# EAGLE design Main Board (EAGLE 7.7.0)
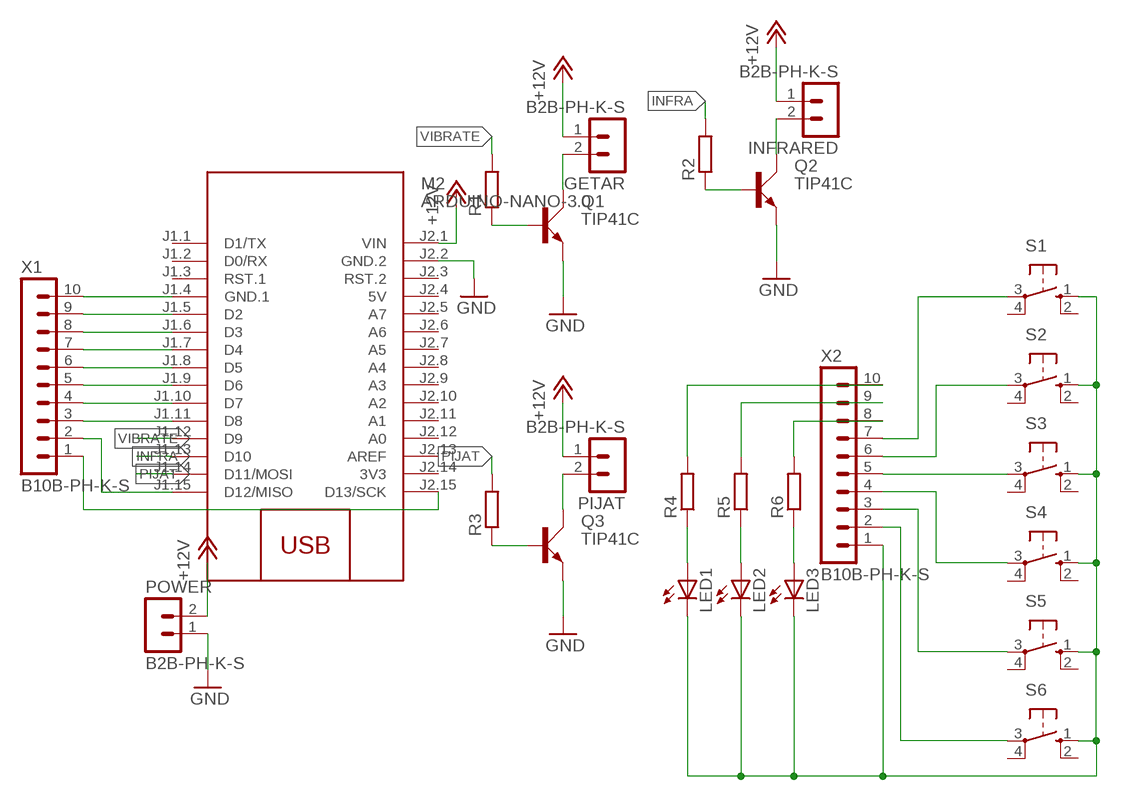
[diagram p0: schematic, sheet 1]

## Parts
GETAR  B2B-PH-K-S  [B2B-PH-K-S]
INFRARED  B2B-PH-K-S  [B2B-PH-K-S]
LED1  LED5MM  [LED5MM]
LED2  LED5MM  [LED5MM]
LED3  LED5MM  [LED5MM]
M2  ARDUINO-NANO-3.0  [ARDUINO-NANO-3.0]
PIJAT  B2B-PH-K-S  [B2B-PH-K-S]
POWER  B2B-PH-K-S  [B2B-PH-K-S]
Q1  TIP41C  [TO220AV]
Q2  TIP41C  [TO220AV]
Q3  TIP41C  [TO220AV]
R1  R-EU_0207/12  [0207/12]
R2  R-EU_0207/12  [0207/12]
R3  R-EU_0207/12  [0207/12]
R4  R-EU_0207/12  [0207/12]
R5  R-EU_0207/12  [0207/12]
R6  R-EU_0207/12  [0207/12]
S1  40-XX  [B3F-40XX]
S2  40-XX  [B3F-40XX]
S3  40-XX  [B3F-40XX]
S4  40-XX  [B3F-40XX]
S5  40-XX  [B3F-40XX]
S6  40-XX  [B3F-40XX]
X1  B10B-PH-K-S  [B10B-PH-K-S]
X2  B10B-PH-K-S  [B10B-PH-K-S]

## Nets
+12V: GETAR.1 INFRARED.1 M2.J2.1(VIN) PIJAT.1 POWER.2
GND: M2.J2.2(GND.2) POWER.1 Q1.E Q2.E Q3.E
INFRA: M2.J1.13(D10) R2.2
N$1: INFRARED.2 Q2.C
N$2: GETAR.2 Q1.C
N$3: PIJAT.2 Q3.C
N$4: M2.J1.4(GND.1) X1.10
N$5: M2.J1.5(D2) X1.9
N$6: M2.J1.6(D3) X1.8
N$7: M2.J1.7(D4) X1.7
N$8: M2.J1.8(D5) X1.6
N$9: M2.J1.9(D6) X1.5
N$10: Q2.B R2.1
N$11: S1.3(P) X2.7
N$12: S2.3(P) X2.6
N$13: S5.3(P) X2.3
N$14: S4.3(P) X2.4
N$15: S3.3(P) X2.5
N$16: M2.J1.10(D7) X1.4
N$17: Q1.B R1.1
N$18: Q3.B R3.1
N$20: M2.J1.11(D8) X1.3
N$21: M2.J1.15(D12/MISO) X1.2
N$22: S6.3(P) X2.2
N$23: M2.J2.15(D13/SCK) X1.1
N$24: LED1.A R4.1
N$25: LED2.A R5.1
N$26: LED3.A R6.1
N$27: R4.2 X2.10
N$28: R5.2 X2.9
N$29: R6.2 X2.8
N$30: LED1.K(C) LED2.K(C) LED3.K(C) S1.1(S) S2.1(S) S3.1(S) S4.1(S) S5.1(S) S6.1(S) X2.1
PIJAT: M2.J1.14(D11/MOSI) R3.2
VIBRATE: M2.J1.12(D9) R1.2
Unconnected: M2.J1.1(D1/TX) M2.J1.2(D0/RX) M2.J1.3(RST.1) M2.J2.3(RST.2) M2.J2.5(A7) M2.J2.6(A6) M2.J2.7(A5) M2.J2.8(A4) M2.J2.9(A3) M2.J2.10(A2) M2.J2.11(A1) M2.J2.12(A0) M2.J2.13(AREF) S1.2(S1) S1.4(P1) S2.2(S1) S2.4(P1) S3.2(S1) S3.4(P1) S4.2(S1) S4.4(P1) S5.2(S1) S5.4(P1) S6.2(S1) S6.4(P1)

## Power pins joined to a net without a drawn wire
3V3: M2.J2.14(3V3)
5V: M2.J2.4(5V)

## Library data of the parts
GETAR INFRARED PIJAT POWER = con-JST PH:B2B-PH: JST PH series header 2.00mm pitch disconnectable crimp style connectors, vertical (side entry type), 2 pins
LED1-LED3 = led:LED: LED OSRAM: - CHIPLED LG R971, LG N971, LY N971, LG Q971, LY Q971, LO R971, LY R971 LH N974, LH R974 LS Q976, LO Q976, LY Q976 LO Q996 - Hyper CHIPLED LW Q18S LB Q993, LB Q99A, LB R99A - SideLED LS A670, LO A670, LY A670, LG A670, LP A670 LB A673, LV A673, LT A673, LW A673 LH A674 LY A675 LS A676, LA A676, LO A676, LY A676, LW A676 LS A679, LY A679, LG A679 - Hyper Micro SIDELED® LS Y876, LA Y876, LO Y876, LY Y876 LT Y87S - SmartLED LW L88C, LW L88S LB L89C, LB L89S, LG L890 LS L89K, LO L89K, LY L89K LS L896, LA L896, LO L896, LY L896 - TOPLED LS T670, LO T670, LY T670, LG T670, LP T670 LSG T670, LSP T670, LSY T670, LOP T670, LYG T670 LG T671, LOG T671, LSG T671 LB T673, LV T673, LT T673, LW T673 LH T674 LS T676, LA T676, LO T676, LY T676, LB T676, LH T676, LSB T676, LW T676 LB T67C, LV T67C, LT T67C, LS T67K, LO T67K, LY T67K, LW E67C LS E67B, LA E67B, LO E67B, LY E67B, LB E67C, LV E67C, LT E67C LW T67C LS T679, LY T679, LG T679 LS T770, LO T770, LY T770, LG T770, LP T770 LB T773, LV T773, LT T773, LW T773 LH T774 LS E675, LA E675, LY E675, LS T675 LS T776, LA T776, LO T776, LY T776, LB T776 LHGB T686 LT T68C, LB T68C - Hyper Mini TOPLED® LB M676 - Mini TOPLED Santana® LG M470 LS M47K, LO M47K, LY M47K Source: http://www.osram.convergy.de LUXEON: - LUMILED® LXK2-PW12-R00, LXK2-PW12-S00, LXK2-PW14-U00, LXK2-PW14-V00 LXK2-PM12-R00, LXK2-PM12-S00, LXK2-PM14-U00 LXK2-PE12-Q00, LXK2-PE12-R00, LXK2-PE12-S00, LXK2-PE14-T00, LXK2-PE14-U00 LXK2-PB12-K00, LXK2-PB12-L00, LXK2-PB12-M00, LXK2-PB14-N00, LXK2-PB14-P00, LXK2-PB14-Q00 LXK2-PR12-L00, LXK2-PR12-M00, LXK2-PR14-Q00, LXK2-PR14-R00 LXK2-PD12-Q00, LXK2-PD12-R00, LXK2-PD12-S00 LXK2-PH12-R00, LXK2-PH12-S00 LXK2-PL12-P00, LXK2-PL12-Q00, LXK2-PL12-R00 Source: www.luxeon.com KINGBRIGHT: KA-3528ASYC Source: www.kingbright.com
M2 = diy-modules:ARDUINO-NANO-3.0: Arduino Nano 3.0 and compatible devices More details available here: https://www.arduino.cc/en/Main/ArduinoBoardNano Click here to find device on ebay.com <http://www.ebay.com/sch/arduino+nano>
Q1-Q3 = transistor-power:TIP41C: NPN TRANSISTOR
R1-R6 = rcl:R-EU_: RESISTOR, European symbol
S1-S6 = switch-omron:40-XX: OMRON SWITCH; MF: OMRON COMPONENTS USA; MPN: B3F-4000; OC_FARNELL: 176434; OC_NEWARK: 36K3105
X1 X2 = con-JST PH:B10B-PH: JST PH series header 2.00mm pitch disconnectable crimp style connectors, vertical (side entry type), 10 pins

## Board
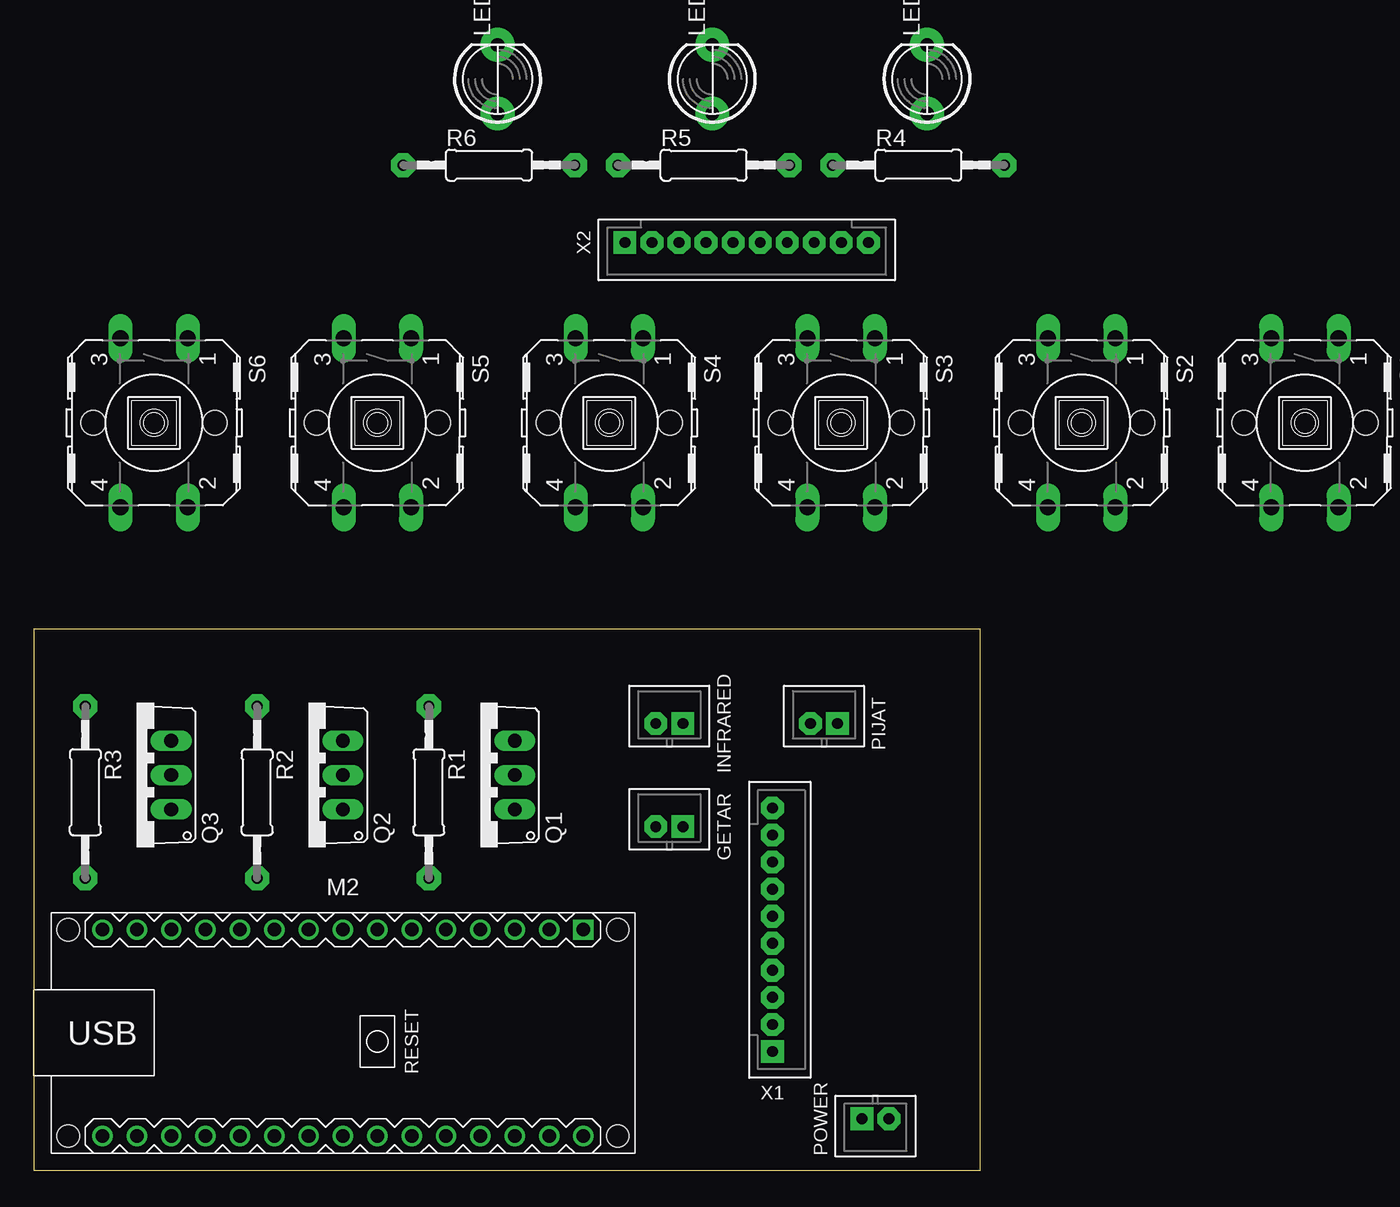
[diagram p1: board, top side]
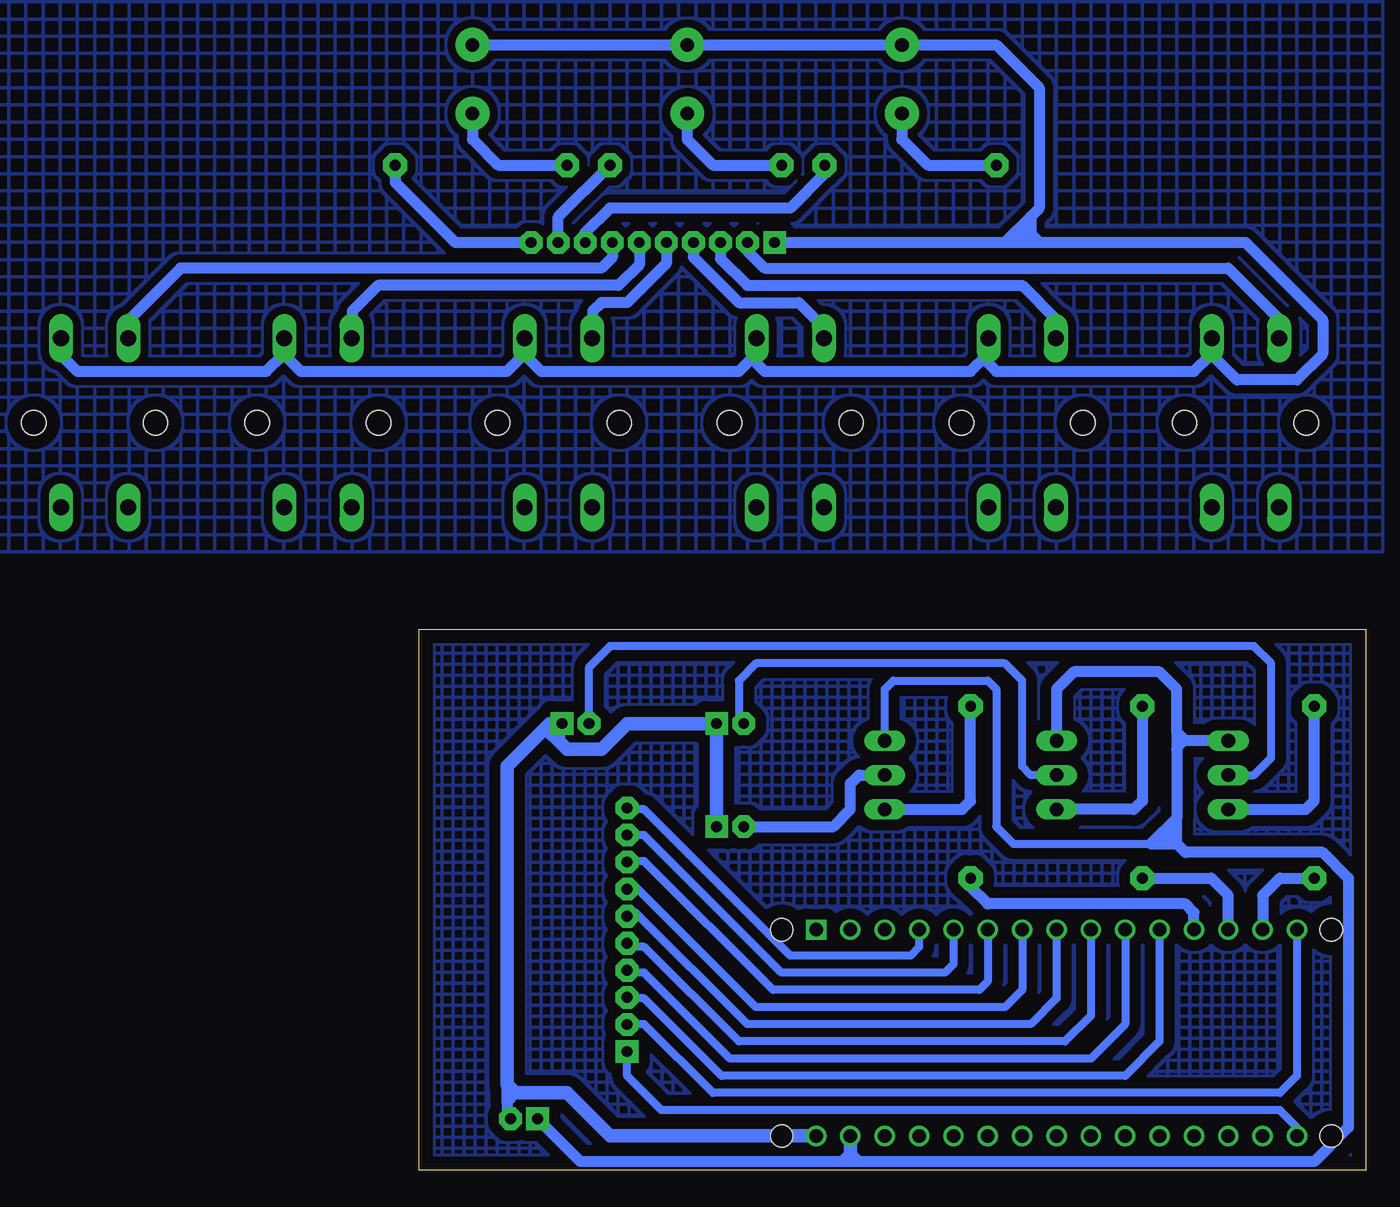
[diagram p2: board, bottom side, seen from below]

Size 70 x 40 mm. Coordinates in mm from the lower left corner, seen from the top.
Outline: 0,0 70,0 70,40 0,40 0,0
Copper layers (1*16): Top 0.035mm / dielectric 1.5mm / Bottom 0.035mm
Design rules "default": minimum track width 10mil, minimum drill 24mil, track to track 8mil, track to pad 8mil, pad to pad 8mil, via to via 8mil, smd to smd 8mil, copper to edge 40mil, drill to drill 8mil, minimum pad ring 10mil, minimum via ring 8mil, stop-mask expansion 4mil, vias tented up to drill 0mil, thermal gap 10mil

### Footprints (pad centres in the part's own frame; a part is rotated, then mirrored left to right if it is on the bottom)
B2B-PH-K-S = drill 0.8 pad 1.676 square: 1 1,0 | drill 0.8 pad 1.676 octagon: 2 -1,0
LED5MM = drill 1 pad 2.5: A -2.54,0; K 2.54,0
ARDUINO-NANO-3.0 = drill 1 square: J1.1 17.78,7.62 | drill 1: J1.2 15.24,7.62; J1.3 12.7,7.62; J1.4 10.16,7.62; J1.5 7.62,7.62; J1.6 5.08,7.62; J1.7 2.54,7.62; J1.8 0,7.62; J1.9 -2.54,7.62; J1.10 -5.08,7.62; J1.11 -7.62,7.62; J1.12 -10.16,7.62; J1.13 -12.7,7.62; J1.14 -15.24,7.62; J1.15 -17.78,7.62; J2.1 17.78,-7.62; J2.2 15.24,-7.62; J2.3 12.7,-7.62; J2.4 10.16,-7.62; J2.5 7.62,-7.62; J2.6 5.08,-7.62; J2.7 2.54,-7.62; J2.8 0,-7.62; J2.9 -2.54,-7.62; J2.10 -5.08,-7.62; J2.11 -7.62,-7.62; J2.12 -10.16,-7.62; J2.13 -12.7,-7.62; J2.14 -15.24,-7.62; J2.15 -17.78,-7.62 | hole 1.651: -20.32,7.62; -20.32,-7.62; 20.32,-7.62; 20.32,7.62
TO220AV = drill 1.016 long: B -2.54,-2.54; C 0,-2.54; E 2.54,-2.54
0207/12 = drill 0.8 pad 1.778 octagon: 1 -6.35,0; 2 6.35,0
B3F-40XX = drill 1.194 long: 1 -6.248,2.489; 2 6.248,2.489; 3 -6.248,-2.489; 4 6.248,-2.489 | hole 1.803: 0,-4.496; 0,4.496
B10B-PH-K-S = drill 0.8 pad 1.676 square: 1 9,0 | drill 0.8 pad 1.676 octagon: 2 7,0; 3 5,0; 4 3,0; 5 1,0; 6 -1,0; 7 -3,0; 8 -5,0; 9 -7,0; 10 -9,0

### Placement (x,y rotation side)
GETAR  46.99,25.4 0 top
INFRARED  46.99,33.02 0 top
LED1  66.04,80.64 90 top  (outside the outline)
LED2  50.16,80.64 90 top  (outside the outline)
LED3  34.29,80.64 90 top  (outside the outline)
M2  22.86,10.16 0 top
PIJAT  58.42,33.02 0 top
POWER  62.23,3.81 180 top
Q1  33.02,29.21 90 top
Q2  20.32,29.21 90 top
Q3  7.62,29.21 90 top
R1  29.21,27.94 270 top
R2  16.51,27.94 270 top
R3  3.81,27.94 270 top
R4  65.41,74.3 0 top  (outside the outline)
R5  49.53,74.3 0 top  (outside the outline)
R6  33.66,74.3 0 top  (outside the outline)
S1  93.98,55.24 270 top  (outside the outline)
S2  77.47,55.24 270 top  (outside the outline)
S3  59.69,55.24 270 top  (outside the outline)
S4  42.55,55.24 270 top  (outside the outline)
S5  25.4,55.24 270 top  (outside the outline)
S6  8.89,55.24 270 top  (outside the outline)
X1  54.61,17.78 270 top
X2  52.7,68.58 180 top  (outside the outline)

### Tracks (layer width: path | path; a pad name or v marks a point on that pad's centre or on a via)
+12V
  Bottom 0.813: 62.87,5.71 63.5,5.08 | 63.5,5.08 63.5,4.08 POWER.2 | 63.5,5.08 63.5,6.35
  Bottom 1.016: GETAR.1 INFRARED.1 54.61,33.02 56.52,31.11 59.05,31.11 59.69,31.75 | 59.69,31.75 59.69,32.75 PIJAT.1 60.33,33.02 63.5,29.84 63.5,6.35 62.87,5.71 59.05,5.71 55.88,2.54 M2.J2.1 | 59.69,31.75 60.33,32.38
GND
  Bottom 0.61: Q1.E 35.56,35.56 34.92,36.2 27.94,36.2 27.3,35.56 27.3,25.4 26.04,24.13 15.88,24.13 14.92,25.08 13.97,26.04 | 13.97,31.11 13.34,31.75
  Bottom 0.813: 38.73,0.64 38.1,1.27 37.47,0.64 | Q3.E 13.34,31.75 13.97,32.38 | 13.97,32.38 13.97,35.56 15.24,36.83 21.59,36.83 22.86,35.56 Q2.E | 13.97,24.13 13.34,23.5 3.17,23.5 1.27,21.59 1.27,3.17 3.81,0.64 37.47,0.64 | 13.97,24.13 14.92,25.08 | 13.97,32.38 13.97,31.11 13.97,26.04 | 13.97,26.04 15.88,24.13 13.97,24.13 | 13.97,24.13 13.97,26.04 | 37.47,0.64 38.73,0.64 | 38.73,0.64 58.05,0.64 POWER.1
  Bottom 1.016: 38.1,1.27 M2.J2.2
INFRA
  Bottom 0.813: R2.2 11.43,21.59 10.16,20.32 M2.J1.13
N$1
  Bottom 0.61: Q2.C 24.77,29.21 25.4,29.84 25.4,36.2 26.67,37.47 45.09,37.47 46.35,36.2 46.35,33.38 INFRARED.2
N$2
  Bottom 0.813: GETAR.2 39.37,25.4 38.1,26.67 38.1,28.57 37.47,29.21 Q1.C
N$3
  Bottom 0.61: Q3.C 8.26,29.21 6.99,30.48 6.99,37.47 8.26,38.73 55.88,38.73 57.42,37.2 PIJAT.2
N$4
  Bottom 0.61: X1.10 54.5,26.67 53.34,26.67 42.55,15.88 33.66,15.88 33.02,16.51 M2.J1.4
N$5
  Bottom 0.61: X1.9 54.59,24.77 53.34,24.77 43.18,14.61 31.11,14.61 30.48,15.24 M2.J1.5
N$6
  Bottom 0.61: M2.J1.6 27.94,13.97 28.57,13.34 43.81,13.34 53.34,22.86 54.53,22.86 X1.8
N$7
  Bottom 0.61: M2.J1.7 25.4,13.34 26.67,12.06 45.09,12.06 53.98,20.95 54.44,20.95 X1.7
N$8
  Bottom 0.61: X1.6 54.34,19.05 53.98,19.05 45.72,10.79 24.77,10.79 22.86,12.7 M2.J1.8
N$9
  Bottom 0.61: M2.J1.9 20.32,11.43 22.23,9.53 46.35,9.53 53.34,16.51 54.34,16.51 X1.5
N$10
  Bottom 0.813: R2.1 16.51,27.3 17.14,26.67 Q2.B
N$11
  Bottom 0.813: X2.7 55.7,67.48 56.52,66.67 87.63,66.67 91.44,62.87 91.44,61.54 S1.3
N$12
  Bottom 0.813: X2.6 53.7,66.94 55.24,65.41 73.03,65.41 74.93,63.5 74.93,61.54 S2.3
N$13
  Bottom 0.813: X2.3 47.7,67.39 45.72,65.41 25.4,65.41 22.86,62.87 22.86,61.54 S5.3
N$14
  Bottom 0.813: X2.4 49.7,67.48 46.35,64.14 41.91,64.14 40.01,62.23 40.01,61.54 S4.3
N$15
  Bottom 0.813: X2.5 51.7,67.04 54.61,64.14 56.52,64.14 57.15,63.5 57.15,61.54 S3.3
N$16
  Bottom 0.61: M2.J1.10 17.78,10.79 20.32,8.26 46.99,8.26 53.34,14.61 54.44,14.61 X1.4
N$17
  Bottom 0.813: Q1.B 29.84,26.67 29.21,27.3 R1.1
N$18
  Bottom 0.813: Q3.B 4.45,26.67 3.81,27.3 R3.1
N$19
  pour Bottom (isolate 0.813, hatched): 0,40.01 0,0 69.85,0 69.85,40.01
N$20
  Bottom 0.61: M2.J1.11 15.24,9.53 17.78,6.99 47.62,6.99 53.34,12.7 54.53,12.7 X1.3
N$21
  Bottom 0.61: M2.J1.15 5.08,6.99 6.35,5.71 48.26,5.71 53.34,10.79 54.59,10.79 X1.2
N$22
  Bottom 0.813: 6.35,61.59 6.4,61.54 S6.3 6.35,61.54 6.35,62.87 10.16,66.67 44.45,66.67 45.7,67.93 X2.2
N$23
  Bottom 0.61: M2.J2.15 5.08,3.17 6.35,4.45 52.07,4.45 54.61,6.99 X1.1
N$24
  Bottom 0.813: LED1.A 66.04,76.2 64.14,74.3 R4.1
N$25
  Bottom 0.813: LED2.A 50.16,76.2 48.26,74.3 R5.1
N$26
  Bottom 0.813: LED3.A 34.29,76.2 32.38,74.3 R6.1
N$27
  Bottom 0.813: R4.2 71.75,73.03 67.31,68.58 X2.10
N$28
  Bottom 0.813: X2.9 59.7,70.47 R5.2
N$29
  Bottom 0.813: R6.2 40.01,73.66 42.55,71.12 55.88,71.12 57.78,69.22 57.78,68.66 X2.8
N$30
  Bottom 0.813: S1.1 96.47,60.27 95.25,59.05 81.28,59.05 80.01,60.33 80.01,61.44 S2.1 79.96,60.27 78.74,59.05 63.5,59.05 62.23,60.33 62.23,61.44 S3.1 62.18,60.27 60.96,59.05 46.35,59.05 45.09,60.33 45.09,61.44 S4.1 45.03,59.64 44.45,59.05 29.21,59.05 27.94,60.33 27.94,61.44 S5.1 27.89,59.64 27.3,59.05 12.7,59.05 11.43,60.33 | 11.43,60.33 11.43,61.44 S6.1 | LED1.K LED2.K | LED2.K LED3.K | X2.1 26.67,68.58 | 26.67,68.58 24.77,68.58 | 24.77,68.58 24.13,68.58 | 24.13,68.58 8.89,68.58 3.17,62.87 3.17,60.33 5.08,58.42 9.53,58.42 11.43,60.33 | LED2.K 27.3,83.19 24.13,80.01 24.13,71.12 24.77,70.48 | 24.77,70.48 26.67,68.58 | 24.77,70.48 24.77,69.22 | 24.77,69.22 24.77,68.58 | 24.77,68.58 25.4,69.22 24.77,69.22 | 24.77,69.22 24.13,68.58
N$31
  pour Bottom (isolate 0.61, hatched): 103.5,45.72 103.5,87.63 -1.27,87.63 -1.27,45.72
PIJAT
  Bottom 0.813: R3.2 6.35,21.59 7.62,20.32 M2.J1.14
VIBRATE
  Bottom 0.813: R1.2 29.21,20.95 27.94,19.68 13.34,19.68 12.7,19.05 M2.J1.12